# EAGLE design KinectIP (EAGLE 9.2.2)
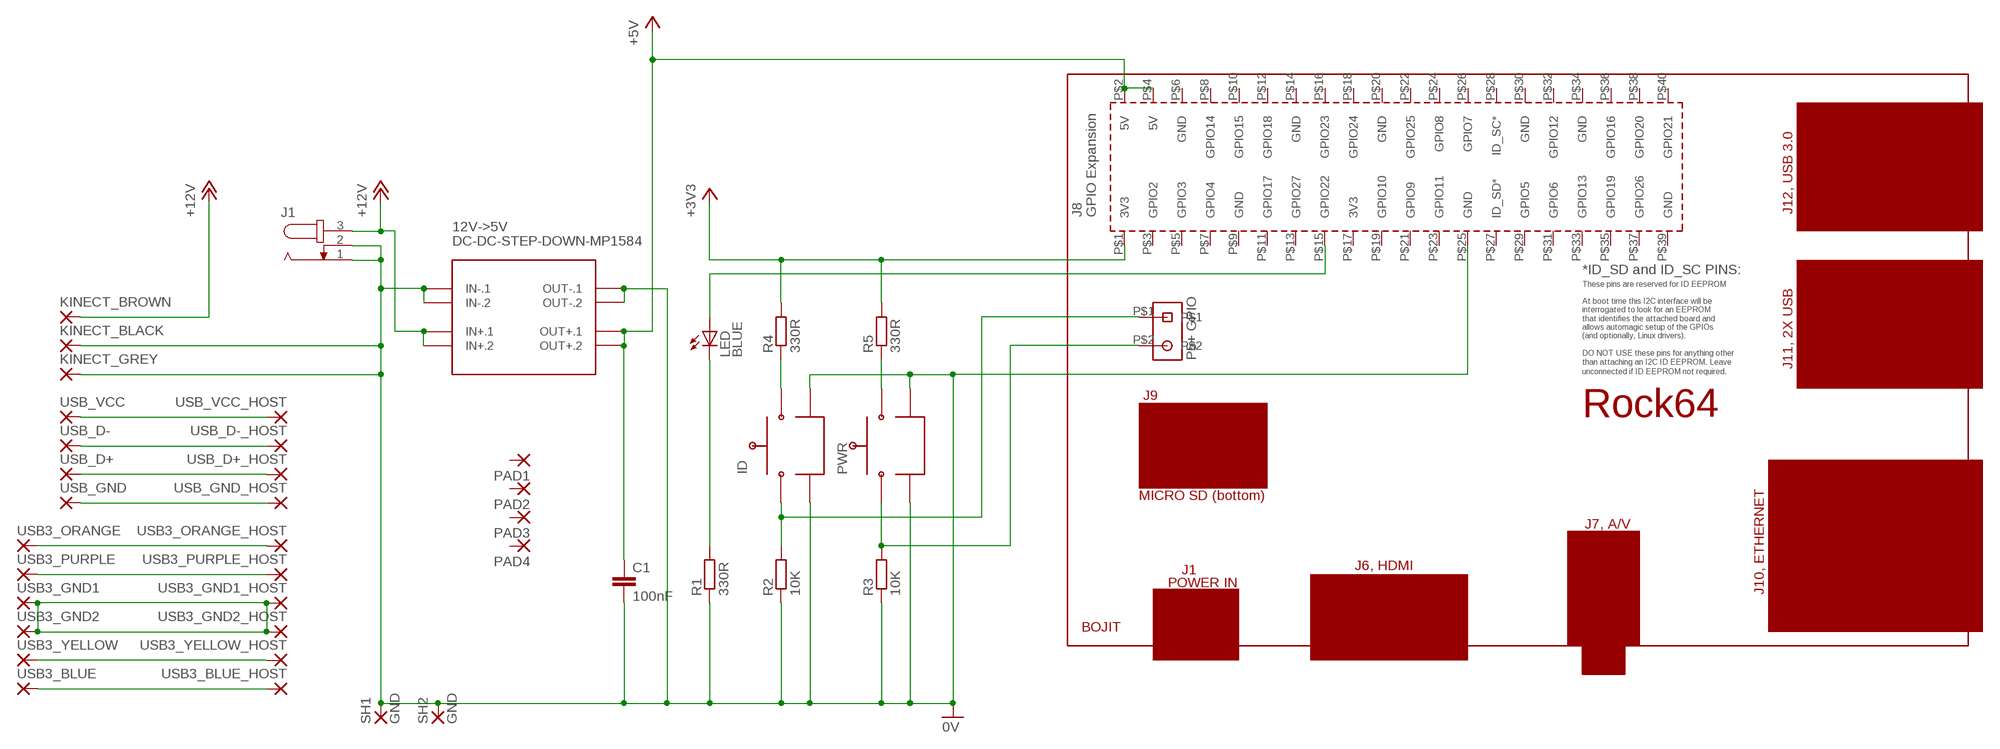
[diagram p0: schematic, sheet 1]

## Parts
12V->5V  DC-DC-STEP-DOWN-MP1584  [DC-DC-STEP-DOWN-MP1584]
C1  100nF  C-EUC0805K  [C0805K]
ID  RIGHT-ANGLE-SWITCH  [RIGHT-ANGLE-SWITCH]
J1  JACK-PLUG-SLOTTED0  [SPC4077]
KINECT_BLACK  SMD2  [SMD1,27-2,54]
KINECT_BROWN  SMD2  [SMD1,27-2,54]
KINECT_GREY  SMD2  [SMD1,27-2,54]
LED  BLUE  LED-90-DEG  [LED-90-DEG]
P5+  2PIN-FEMALE-HEADER  [2PIN-FEMALE-HEADER]
PAD1  1,6/0,8  [1,6/0,8]
PAD2  1,6/0,8  [1,6/0,8]
PAD3  1,6/0,8  [1,6/0,8]
PAD4  1,6/0,8  [1,6/0,8]
PCB2  ROCK64ROCK64  [ROCK64]
PWR  RIGHT-ANGLE-SWITCH  [RIGHT-ANGLE-SWITCH]
R1  330R  R-EU_R0805  [R0805]
R2  10K  R-EU_R0805  [R0805]
R3  10K  R-EU_R0805  [R0805]
R4  330R  R-EU_R0805  [R0805]
R5  330R  R-EU_R0805  [R0805]
SH1  GND  SMD5  [SMD2,54-5,08]
SH2  GND  SMD5  [SMD2,54-5,08]
U$1  BOJIT_COPPER  [BOJIT_LARGE_COPPER]
USB3_BLUE  SMD2  [SMD1,27-2,54]
USB3_BLUE_HOST  SMD2  [SMD1,27-2,54]
USB3_GND1  SMD2  [SMD1,27-2,54]
USB3_GND1_HOST  SMD2  [SMD1,27-2,54]
USB3_GND2  SMD2  [SMD1,27-2,54]
USB3_GND2_HOST  SMD2  [SMD1,27-2,54]
USB3_ORANGE  SMD2  [SMD1,27-2,54]
USB3_ORANGE_HOST  SMD2  [SMD1,27-2,54]
USB3_PURPLE  SMD2  [SMD1,27-2,54]
USB3_PURPLE_HOST  SMD2  [SMD1,27-2,54]
USB3_YELLOW  SMD2  [SMD1,27-2,54]
USB3_YELLOW_HOST  SMD2  [SMD1,27-2,54]
USB_D+  SMD2  [SMD1,27-2,54]
USB_D+_HOST  SMD2  [SMD1,27-2,54]
USB_D-  SMD2  [SMD1,27-2,54]
USB_D-_HOST  SMD2  [SMD1,27-2,54]
USB_GND  SMD2  [SMD1,27-2,54]
USB_GND_HOST  SMD2  [SMD1,27-2,54]
USB_VCC  SMD2  [SMD1,27-2,54]
USB_VCC_HOST  SMD2  [SMD1,27-2,54]

## Nets
0V: 12V->5V.IN-.1 12V->5V.IN-.2 12V->5V.OUT-.1 12V->5V.OUT-.2 C1.2 ID.MNT$1 ID.MNT$2 J1.1 J1.2 KINECT_BLACK.1(P) KINECT_GREY.1(P) PCB2.P$25(GND) PWR.MNT$1 PWR.MNT$2 R1.1 R2.1 R3.1 SH1.1(P) SH2.1(P)
+3V3: PCB2.P$1(3V3) R4.2 R5.2
+5V: 12V->5V.OUT+.1 12V->5V.OUT+.2 C1.1 PCB2.P$2(5V) PCB2.P$4(5V)
+12V: 12V->5V.IN+.1 12V->5V.IN+.2 J1.3 KINECT_BROWN.1(P)
N$1: LED.A PCB2.P$15(GPIO22)
N$2: LED.K(C) R1.2
N$3: ID.SW$2 R4.1
N$4: PWR.SW$2 R5.1
N$5: ID.SW$1 P5+.P$1 R2.2
N$6: P5+.P$2 PWR.SW$1 R3.2
N$7: USB_VCC.1(P) USB_VCC_HOST.1(P)
N$8: USB_D-.1(P) USB_D-_HOST.1(P)
N$9: USB_D+.1(P) USB_D+_HOST.1(P)
N$10: USB_GND.1(P) USB_GND_HOST.1(P)
N$11: USB3_ORANGE.1(P) USB3_ORANGE_HOST.1(P)
N$12: USB3_PURPLE.1(P) USB3_PURPLE_HOST.1(P)
N$13: USB3_GND1.1(P) USB3_GND1_HOST.1(P) USB3_GND2.1(P) USB3_GND2_HOST.1(P)
N$15: USB3_YELLOW.1(P) USB3_YELLOW_HOST.1(P)
N$16: USB3_BLUE.1(P) USB3_BLUE_HOST.1(P)
Unconnected: PAD1.1(P) PAD2.1(P) PAD3.1(P) PAD4.1(P) PCB2.P$3(GPIO2) PCB2.P$5(GPIO3) PCB2.P$6(GND) PCB2.P$7(GPIO4) PCB2.P$8(GPIO14) PCB2.P$9(GND) PCB2.P$10(GPIO15) PCB2.P$11(GPIO17) PCB2.P$12(GPIO18) PCB2.P$13(GPIO27) PCB2.P$14(GND) PCB2.P$16(GPIO23) PCB2.P$17(3V3) PCB2.P$18(GPIO24) PCB2.P$19(GPIO10) PCB2.P$20(GND) PCB2.P$21(GPIO9) PCB2.P$22(GPIO25) PCB2.P$23(GPIO11) PCB2.P$24(GPIO8) PCB2.P$26(GPIO7) PCB2.P$27(ID_SD*) PCB2.P$28(ID_SC*) PCB2.P$29(GPIO5) PCB2.P$30(GND) PCB2.P$31(GPIO6) PCB2.P$32(GPIO12) PCB2.P$33(GPIO13) PCB2.P$34(GND) PCB2.P$35(GPIO19) PCB2.P$36(GPIO16) PCB2.P$37(GPIO26) PCB2.P$38(GPIO20) PCB2.P$39(GND) PCB2.P$40(GPIO21)

## Notes on the sheet
- P5+ GPIO

## Library data of the parts
12V->5V = diy-modules:DC-DC-STEP-DOWN-MP1584: DC/DC Step-Down Regulator based on MP1584 chip MP1584 datasheet available here: http://www.haoyuelectronics.com/Attachment/MP1584/MP1584.pdf Click here to find device on ebay.com <http://www.ebay.com/sch/mp1584+module>
C1 = rcl:C-EU: CAPACITOR, European symbol; SPICEPREFIX: C
ID PWR = Right-Angle-Switch:RIGHT-ANGLE-SWITCH
J1 = con-jack-3D:JACK-PLUG-SLOTTED: DC POWER JACK Power Jack, DC, Right Angle, Through Hole, Rated 5A at 16VDC, PC Terminals Distributor: Farnell (www.Farnell.de) Drawing: 84N1161.pdf / 84N1162.pdf Manufacturer: SPC Technology (www.spctechnology.com) Type: SPC4077 / SPC 4078; OC_FARNELL: unknown; OC_NEWARK: unknown
KINECT_BLACK KINECT_BROWN KINECT_GREY USB3_BLUE USB3_BLUE_HOST USB3_GND1 USB3_GND1_HOST USB3_GND2 USB3_GND2_HOST USB3_ORANGE USB3_ORANGE_HOST USB3_PURPLE USB3_PURPLE_HOST USB3_YELLOW USB3_YELLOW_HOST USB_D+ USB_D+_HOST USB_D- USB_D-_HOST USB_GND USB_GND_HOST USB_VCC USB_VCC_HOST = wirepad:SMD2: SMD PAD
LED = LED-90-Degree:LED-90-DEG
P5+ = Female-Header:2PIN-FEMALE-HEADER
PAD1-PAD4 = wirepad:1,6/0,8: THROUGH-HOLE PAD
PCB2 = Rock64:ROCK64: Device for Rock64 SBC SBC and Development Board Libraries are located at https://github.com/BOJIT/EAGLE
R1-R5 = rcl:R-EU_: RESISTOR, European symbol; SPICEPREFIX: R
SH1 SH2 = wirepad:SMD5: SMD PAD
U$1 = BOJIT Logos:BOJIT_COPPER

## Board
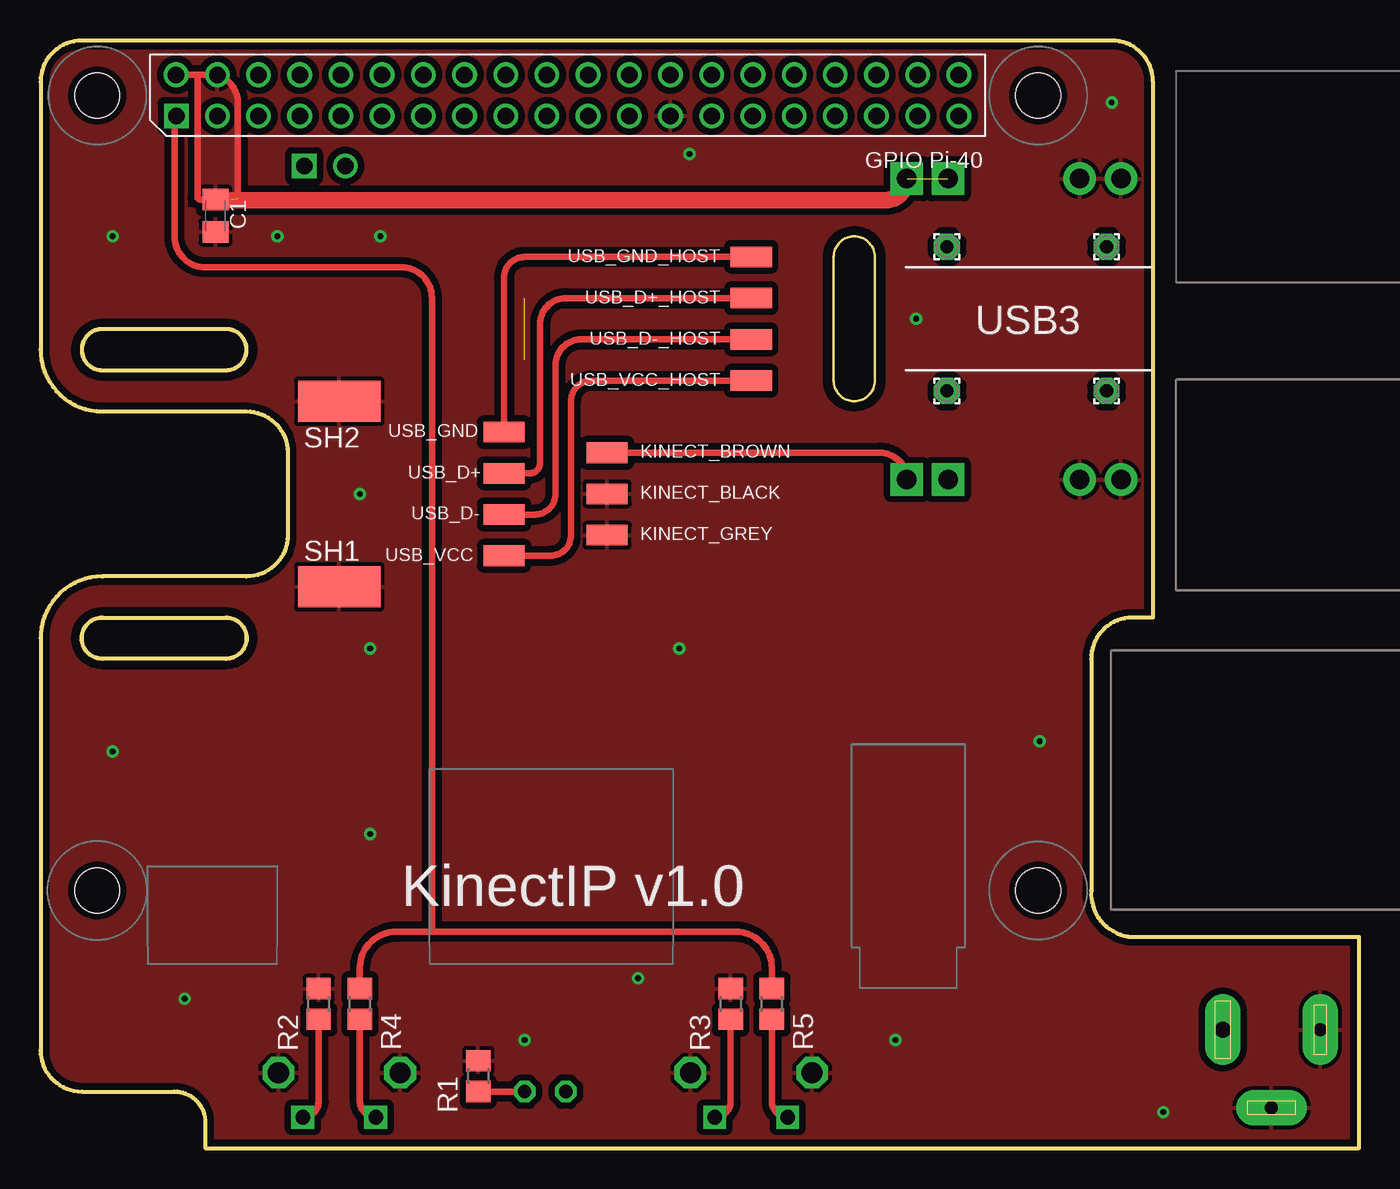
[diagram p1: board, top side]
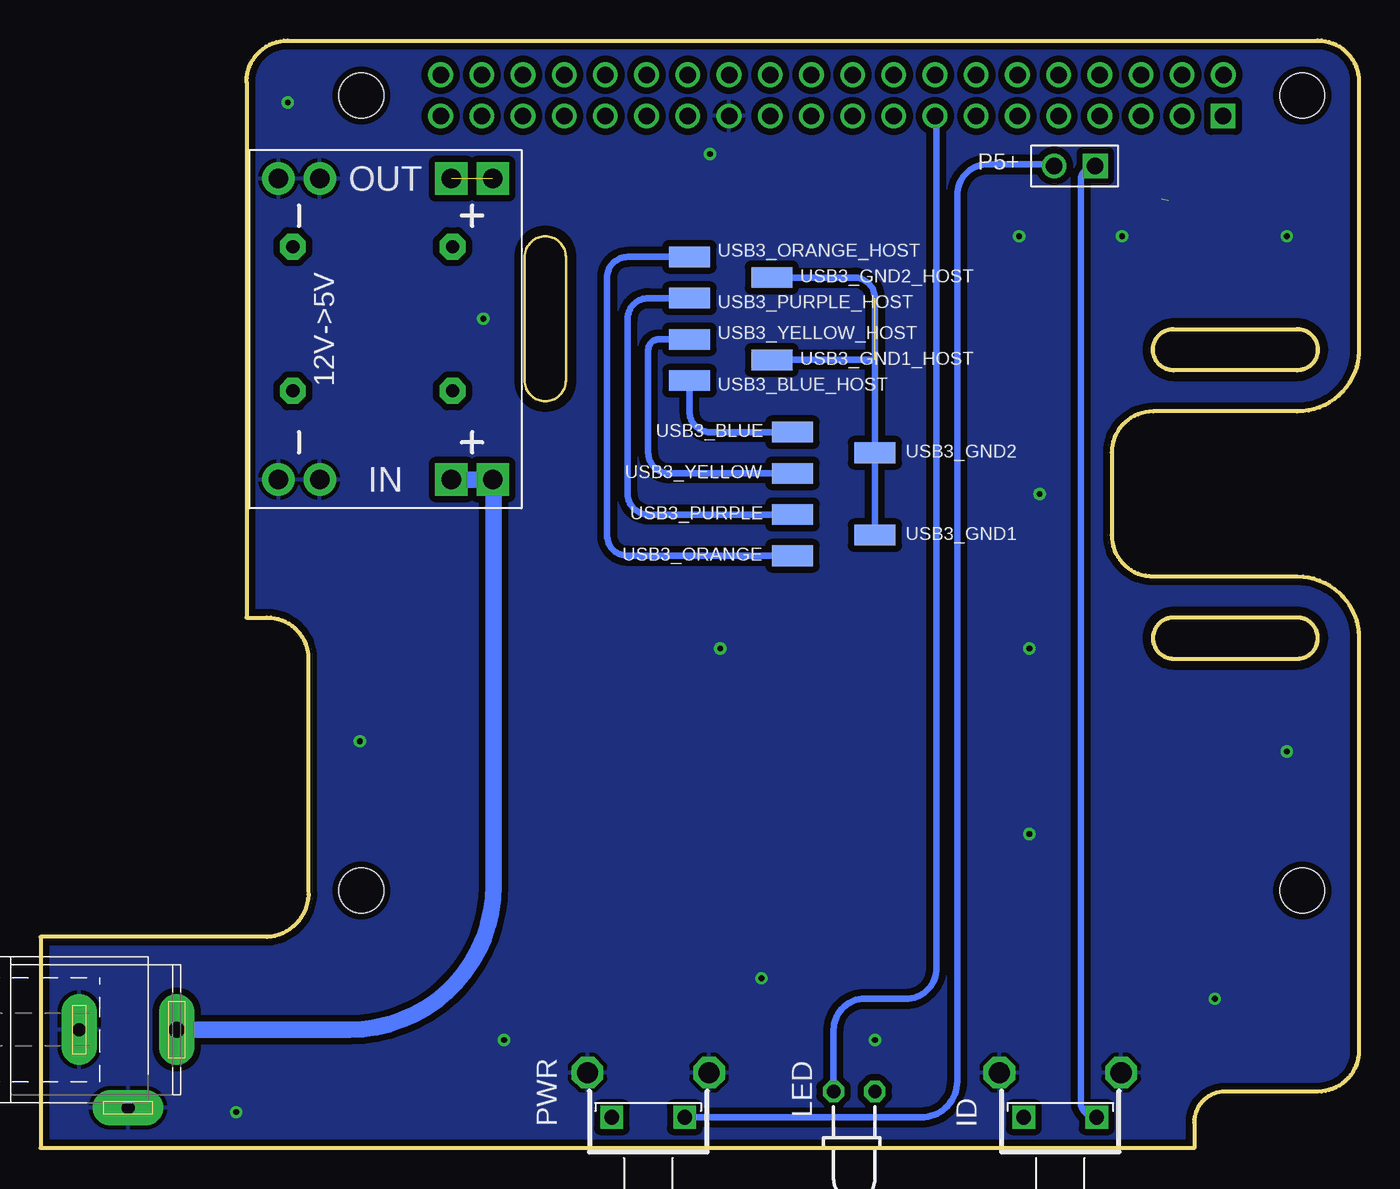
[diagram p2: board, bottom side, seen from below]

Size 81.28 x 68.26 mm. Coordinates in mm from the lower left corner, seen from the top.
Outline: 2.54,68.26 arc90 0,65.72 0,49.21 arc90 3.81,45.4 12.7,45.4 arc-90 15.24,42.86 15.24,37.78 arc-90 12.7,35.24 3.81,35.24 arc90 0,31.43 0,6.03 arc90 2.54,3.49 8.26,3.49 arc-90 10.16,1.59 10.16,0 81.28,0 81.28,13.02 67.31,13.02 arc-90 64.77,15.87 64.77,30.16 arc-90 67.31,32.7 68.58,32.7 68.58,65.72 arc90 66.04,68.26 2.54,68.26
Copper layers (1*16): Top 0.035mm / dielectric 1.5mm / Bottom 0.035mm
Design rules "default *": minimum track width 6mil, minimum drill 0.35mm, track to track 6mil, track to pad 6mil, pad to pad 6mil, via to via 6mil, smd to smd 6mil, copper to edge 6mil, drill to drill 6mil, minimum pad ring 10mil, minimum via ring 8mil, stop-mask expansion 4mil, vias tented up to drill 0mil, thermal gap 10mil
Milling: 18 lines

### Footprints (pad centres in the part's own frame; a part is rotated, then mirrored left to right if it is on the bottom)
DC-DC-STEP-DOWN-MP1584 = drill 1.2 pad 2 square: IN+.1 -9.271,-4.064; IN+.2 -9.271,-6.604; OUT+.1 9.271,-4.064; OUT+.2 9.271,-6.604 | drill 1.2 pad 2: IN-.1 -9.271,6.604; IN-.2 -9.271,4.064; OUT-.1 9.271,6.604; OUT-.2 9.271,4.064
C0805K = smd 1.3 x 1.6: 1 -1,0; 2 1,0
RIGHT-ANGLE-SWITCH = drill 1.3 octagon: MNT$1 -3.75,-2.75; MNT$2 3.75,-2.75 | drill 0.9 square: SW$1 -2.25,0; SW$2 2.25,0
SPC4077 = drill 0.8 pad 2.184 long: 1 -3,0; 2 0,-4.8 | drill 1 pad 2.184 long: 3 3,0
SMD1,27-2,54 = smd 1.27 x 2.54: 1 0,0
LED-90-DEG = drill 0.813 octagon: A -1.27,0; K 1.27,0
2PIN-FEMALE-HEADER = drill 1.016 square: P$1 0,0 | drill 1.016: P$2 2.54,0
1,6/0,8 = drill 0.813 pad 1.6 octagon: 1 0,0
ROCK64 = drill 1.016 square: P$1 8.37,51.23 | drill 1.016: P$2 8.357,53.772; P$3 10.897,51.232; P$4 10.897,53.772; P$5 13.437,51.232; P$6 13.437,53.772; P$7 15.977,51.232; P$8 15.977,53.772; P$9 18.517,51.232; P$10 18.517,53.772; P$11 21.057,51.232; P$12 21.057,53.772; P$13 23.597,51.232; P$14 23.597,53.772; P$15 26.137,51.232; P$16 26.137,53.772; P$17 28.677,51.232; P$18 28.677,53.772; P$19 31.217,51.232; P$20 31.217,53.772; P$21 33.757,51.232; P$22 33.757,53.772; P$23 36.297,51.232; P$24 36.297,53.772; P$25 38.837,51.232; P$26 38.837,53.772; P$27 41.377,51.232; P$28 41.377,53.772; P$29 43.917,51.232; P$30 43.917,53.772; P$31 46.457,51.232; P$32 46.457,53.772; P$33 48.997,51.232; P$34 48.997,53.772; P$35 51.537,51.232; P$36 51.537,53.772; P$37 54.077,51.232; P$38 54.077,53.772; P$39 56.617,51.232; P$40 56.617,53.772 | hole 2.75: 3.5,3.5; 61.5,3.5; 3.5,52.5; 61.5,52.5
R0805 = smd 1.3 x 1.5: 1 -0.95,0; 2 0.95,0
SMD2,54-5,08 = smd 2.54 x 5.08: 1 0,0

### Placement (x,y rotation side)
12V->5V  60.01,50.48 90 bottom
C1  10.79,57.47 270 top
ID  18.41,1.91 180 bottom
J1  75.88,7.3 0 bottom
KINECT_BLACK  34.92,40.32 270 top
KINECT_BROWN  34.92,42.86 270 top
KINECT_GREY  34.92,37.78 270 top
LED  31.11,3.49 0 bottom
P5+  16.25,60.54 180 bottom
PAD1  65.72,55.56 0 top
PAD2  65.72,46.67 0 top
PAD3  55.88,55.56 0 top
PAD4  55.88,46.67 0 top
PCB2  0,12.38 0 top
PWR  43.81,1.91 180 bottom
R1  26.99,4.45 270 top
R2  17.14,8.89 270 top
R3  42.55,8.89 270 top
R4  19.68,8.89 90 top
R5  45.09,8.89 90 top
SH1  18.41,34.61 90 top
SH2  18.41,46.04 90 top
U$1  62.23,5.4 0 top
USB3_BLUE  34.92,44.13 270 bottom
USB3_BLUE_HOST  41.27,47.31 270 bottom
USB3_GND1  29.84,37.78 270 bottom
USB3_GND1_HOST  36.2,48.58 270 bottom
USB3_GND2  29.84,42.86 270 bottom
USB3_GND2_HOST  36.2,53.66 270 bottom
USB3_ORANGE  34.92,36.51 270 bottom
USB3_ORANGE_HOST  41.27,54.93 270 bottom
USB3_PURPLE  34.92,39.05 270 bottom
USB3_PURPLE_HOST  41.27,52.39 270 bottom
USB3_YELLOW  34.92,41.59 270 bottom
USB3_YELLOW_HOST  41.27,49.85 270 bottom
USB_D+  28.57,41.59 90 top
USB_D+_HOST  43.81,52.39 90 top
USB_D-  28.57,39.05 270 top
USB_D-_HOST  43.81,49.85 90 top
USB_GND  28.57,44.13 270 top
USB_GND_HOST  43.81,54.93 90 top
USB_VCC  28.57,36.51 90 top
USB_VCC_HOST  43.81,47.31 90 top

### Tracks (layer width: path | path; a pad name or v marks a point on that pad's centre or on a via)
0V  (via drill 0.35)
  other vias: 69.22,2.22 52.7,6.67 36.83,10.48 29.84,6.67 8.89,9.21 4.45,24.45 20.32,30.8 20.32,19.37 39.37,30.8 61.59,25.08 53.98,51.12 66.04,64.45 40.01,61.28 19.68,40.32 4.45,56.2 14.61,56.2 20.95,56.2
  pour Top (isolate 0.406, rank 6): 2.54,68.26 66.04,68.26 arc-90 68.58,65.72 68.58,32.7 67.31,32.7 arc90 64.77,30.16 64.77,15.56 arc90 67.31,13.02 81.28,13.02 81.28,0 10.16,0 10.16,1.59 arc90 8.26,3.49 2.54,3.49 arc-90 0,6.03 0,31.43 arc-90 3.81,35.24 12.7,35.24 arc90 15.24,37.78 15.24,42.86 arc90 12.7,45.4 3.81,45.4 arc-90 0,49.21 0,65.72 arc-90
  cutout Top (isolate 0.406): 3.81,51.12 11.43,51.12 arc-90 13.34,49.21 arc-90 11.43,47.31 3.81,47.31 arc-90 1.91,49.21 arc-90
  cutout Top (isolate 0.406): 3.81,33.34 11.43,33.34 arc-90 13.34,31.43 arc-90 11.43,29.53 3.81,29.53 arc-90 1.91,31.43 arc-90
  cutout Top (isolate 0.406): 48.26,47.31 48.26,54.93 arc-90 50.16,56.83 arc-90 52.07,54.93 52.07,47.31 arc-90 50.16,45.4 arc-90
  pour Bottom (isolate 0.406): 2.54,68.26 66.04,68.26 arc-90 68.58,65.72 68.58,32.7 67.31,32.7 arc90 64.77,30.16 64.77,15.56 arc90 67.31,13.02 81.28,13.02 81.28,0 10.16,0 10.16,1.59 arc90 8.26,3.49 2.54,3.49 arc-90 0,6.03 0,31.43 arc-90 3.81,35.24 12.7,35.24 arc90 15.24,37.78 15.24,42.86 arc90 12.7,45.4 3.81,45.4 arc-90 0,49.21 0,65.72 arc-90
0V1
  cutout Bottom (isolate 0.406): 3.81,51.12 11.43,51.12 arc-90 13.34,49.21 arc-90 11.43,47.31 3.81,47.31 arc-90 1.91,49.21 arc-90
  cutout Bottom (isolate 0.406): 3.81,33.34 11.43,33.34 arc-90 13.34,31.43 arc-90 11.43,29.53 3.81,29.53 arc-90 1.91,31.43 arc-90
  cutout Bottom (isolate 0.406): 48.26,47.31 48.26,54.93 arc-90 50.16,56.83 arc-90 52.07,54.93 52.07,47.31 arc-90 50.16,45.4 arc-90
+3V3
  Top 0.406: R5.2 45.09,11.11 arc90 42.86,13.33 24.13,13.33 | 24.13,13.33 21.91,13.33 arc90 19.68,11.11 R4.2 | 24.13,13.33 24.13,52.39 arc90 22.23,54.29 10.16,54.29 arc-90 8.26,56.2 8.26,63.5 arc-90 PCB2.P$1
+5V  (2 unrouted)
  Top 0.406: PCB2.P$2 9.53,66.15 | 9.53,66.15 10.48,66.15 arc-85 12.14,64.64 12.14,58.5 | 9.53,66.15 arc-90 9.68,66 9.68,58.63 arc90 9.84,58.47 C1.1
  Top 1.016: 12V->5V.OUT+.2 arc-90 52.07,58.42 11.75,58.42
  pour Top (isolate 0.406, rank 3): 9.53,66.04 10.48,66.04 arc-90 12.06,64.45 12.06,58.42 9.53,58.42 9.53,61.91 9.68,61.91 9.68,65.88 arc90
+12V
  Top 0.406: KINECT_BROWN.1 51.75,42.86 arc-90 12V->5V.IN+.2
  Bottom 1.016: J1.3 62.23,7.3 arc-90 53.34,16.19 53.34,41.15 arc-90 12V->5V.IN+.2 12V->5V.IN+.1
N$1
  Bottom 0.406: LED.A 32.38,7.3 arc90 30.48,9.21 27.94,9.21 arc-90 26.04,11.11 26.04,63.51 arc-90 PCB2.P$15
N$2
  Top 0.406: LED.K R1.2 arc-90 R1.2
N$3
  Top 0.406: ID.SW$2 arc-90 19.68,2.89 R4.1
N$4
  Top 0.406: PWR.SW$2 arc-90 45.09,2.89 R5.1
N$5
  Top 0.406: ID.SW$1 arc90 17.14,2.89 R2.2
  Bottom 0.406: ID.SW$1 16.19,1.91 arc90 17.14,2.86 17.14,59.65 arc90 P5+.P$1
N$6
  Top 0.406: PWR.SW$1 arc90 42.55,2.89 R3.2
  Bottom 0.406: PWR.SW$1 26.99,1.91 arc-90 24.77,4.13 24.77,58.74 arc90 22.86,60.64 18.9,60.64 arc90 P5+.P$2
N$7
  Top 0.406: USB_VCC.1 31.43,36.51 arc90 32.7,37.78 32.7,46.04 arc-90 33.97,47.31 USB_VCC_HOST.1
N$8
  Top 0.406: USB_D-.1 30.48,39.05 arc90 31.75,40.32 31.75,48.26 arc-90 33.34,49.85 USB_D-_HOST.1
N$9
  Top 0.406: USB_D+_HOST.1 32.38,52.39 arc90 30.8,50.8 30.8,42.23 arc-90 30.16,41.59 USB_D+.1
N$10
  Top 0.406: USB_GND.1 28.57,53.66 arc-90 29.84,54.93 USB_GND_HOST.1
N$11
  Bottom 0.406: USB3_ORANGE.1 45.09,36.51 arc90 46.35,37.78 46.35,53.66 arc90 45.09,54.93 USB3_ORANGE_HOST.1
N$12
  Bottom 0.406: USB3_PURPLE.1 43.81,39.05 arc90 45.09,40.32 45.09,51.12 arc90 43.81,52.39 USB3_PURPLE_HOST.1
N$13  (1 unrouted)
  Bottom 0.406: USB3_GND1.1 29.84,48.58 USB3_GND1_HOST.1 | USB3_GND2_HOST.1 31.11,53.66 arc90 29.84,52.39 USB3_GND2.1
N$15
  Bottom 0.406: USB3_YELLOW.1 42.55,41.59 arc90 43.81,42.86 43.81,49.21 arc90 43.18,49.85 USB3_YELLOW_HOST.1
N$16
  Bottom 0.406: USB3_BLUE.1 40.01,44.13 arc90 41.27,45.4 USB3_BLUE_HOST.1

### Text on the board
tPlace: USB3 | KinectIP v1.0